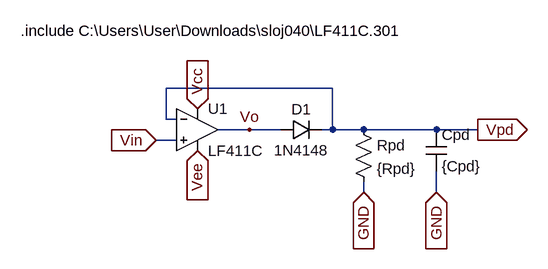
[diagram p0: schematic peak_detector.asc]
peak_detector.asc, the LTspice schematic file:
Version 4
SHEET 1 2072 680
WIRE 336 0 80 0
WIRE 80 48 80 0
WIRE 96 48 80 48
WIRE 208 64 160 64
WIRE 256 64 208 64
WIRE 336 64 336 0
WIRE 336 64 320 64
WIRE 384 64 336 64
WIRE 496 64 384 64
WIRE 560 64 496 64
WIRE 96 80 64 80
WIRE 384 160 384 144
WIRE 496 160 496 128
FLAG 208 64 Vo
FLAG 64 80 Vin
IOPIN 64 80 In
FLAG 128 32 Vcc
IOPIN 128 32 In
FLAG 128 96 Vee
IOPIN 128 96 In
FLAG 560 64 Vpd
IOPIN 560 64 Out
FLAG 384 160 GND
IOPIN 384 160 In
FLAG 496 160 GND
IOPIN 496 160 In
SYMBOL diode 256 80 R270
WINDOW 0 32 32 VTop 2
WINDOW 3 0 32 VBottom 2
SYMATTR InstName D1
SYMATTR Value 1N4148
SYMBOL res 368 48 R0
SYMATTR InstName Rpd
SYMATTR Value {Rpd}
SYMBOL cap 480 64 R0
SYMATTR InstName Cpd
SYMATTR Value {Cpd}
SYMBOL OpAmps\\opamp2 128 0 R0
SYMATTR InstName U1
SYMATTR Value LF411C
TEXT -144 -88 Left 2 !.include C:\\Users\\User\\Downloads\\sloj040\\LF411C.301

The netlist it stands for:
* peak_detector.asc
D1 Vo Vpd 1N4148
Rpd Vpd GND {Rpd}
Cpd Vpd GND {Cpd}
XU1 Vin Vpd Vcc Vee Vo LF411C  ; pins In+ In- V+ V- OUT
.model D D
.lib standard.dio
.include C:\Users\User\Downloads\sloj040\LF411C.301
.backanno
.end